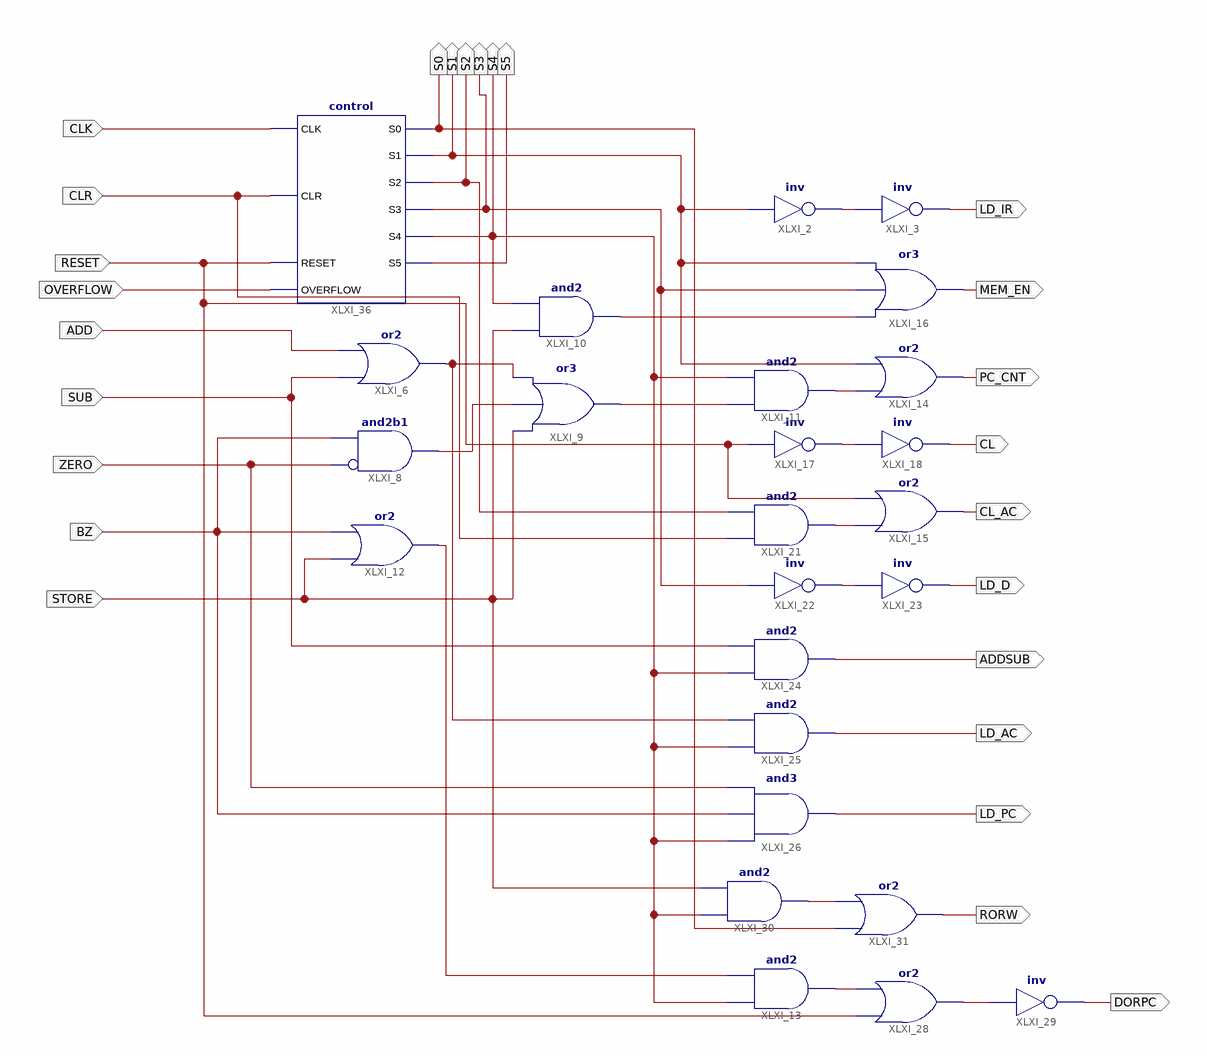
[diagram p0: schematic sheet 1]
// Xilinx ISE schematic controller.sch (spartan3e) as structural Verilog: 25 symbols, 26 ports
module controller (
  input  CLK,
  input  CLR,
  input  RESET,
  input  ADD,
  input  SUB,
  input  ZERO,
  input  BZ,
  input  STORE,
  input  OVERFLOW,
  output S1,
  output LD_IR,
  output PC_CNT,
  output S3,
  output S4,
  output MEM_EN,
  output CL,
  output S2,
  output CL_AC,
  output S0,
  output S5,
  output ADDSUB,
  output LD_AC,
  output LD_PC,
  output RORW,
  output DORPC,
  output LD_D
);

  wire XLXN_5, XLXN_20, XLXN_23, XLXN_26, XLXN_27, XLXN_30, XLXN_34, XLXN_39, XLXN_54, XLXN_60, XLXN_72,
       XLXN_74, XLXN_82;

  not XLXI_2 (XLXN_5, S1);
  not XLXI_3 (LD_IR, XLXN_5);
  or XLXI_6 (XLXN_60, SUB, ADD);
  and XLXI_8 (XLXN_20, ~ZERO, BZ);  // and2b1
  or XLXI_9 (XLXN_26, STORE, XLXN_20, XLXN_60);
  and XLXI_10 (XLXN_30, STORE, S4);
  and XLXI_11 (XLXN_27, XLXN_26, S4);
  or XLXI_12 (XLXN_23, STORE, BZ);
  and XLXI_13 (XLXN_72, S4, XLXN_23);
  or XLXI_14 (PC_CNT, XLXN_27, S1);
  or XLXI_15 (CL_AC, XLXN_39, RESET);
  or XLXI_16 (MEM_EN, XLXN_30, S3, S1);
  not XLXI_18 (CL, XLXN_34);
  not XLXI_17 (XLXN_34, RESET);
  and XLXI_21 (XLXN_39, CLR, S2);
  not XLXI_22 (XLXN_54, S3);
  not XLXI_23 (LD_D, XLXN_54);
  and XLXI_24 (ADDSUB, S4, SUB);
  and XLXI_25 (LD_AC, S4, XLXN_60);
  and XLXI_26 (LD_PC, S4, BZ, ZERO);
  or XLXI_28 (XLXN_74, RESET, XLXN_72);
  not XLXI_29 (DORPC, XLXN_74);
  and XLXI_30 (XLXN_82, S4, STORE);
  or XLXI_31 (RORW, S0, XLXN_82);
  control XLXI_36 (
    .CLK(CLK), .CLR(CLR), .RESET(RESET), .OVERFLOW(OVERFLOW), .S0(S0), .S1(S1), .S2(S2), .S3(S3), .S4(S4),
    .S5(S5));
endmodule
